# Altium schematic sheet GSB-S05-V00-CAN3.SchDoc
size A4
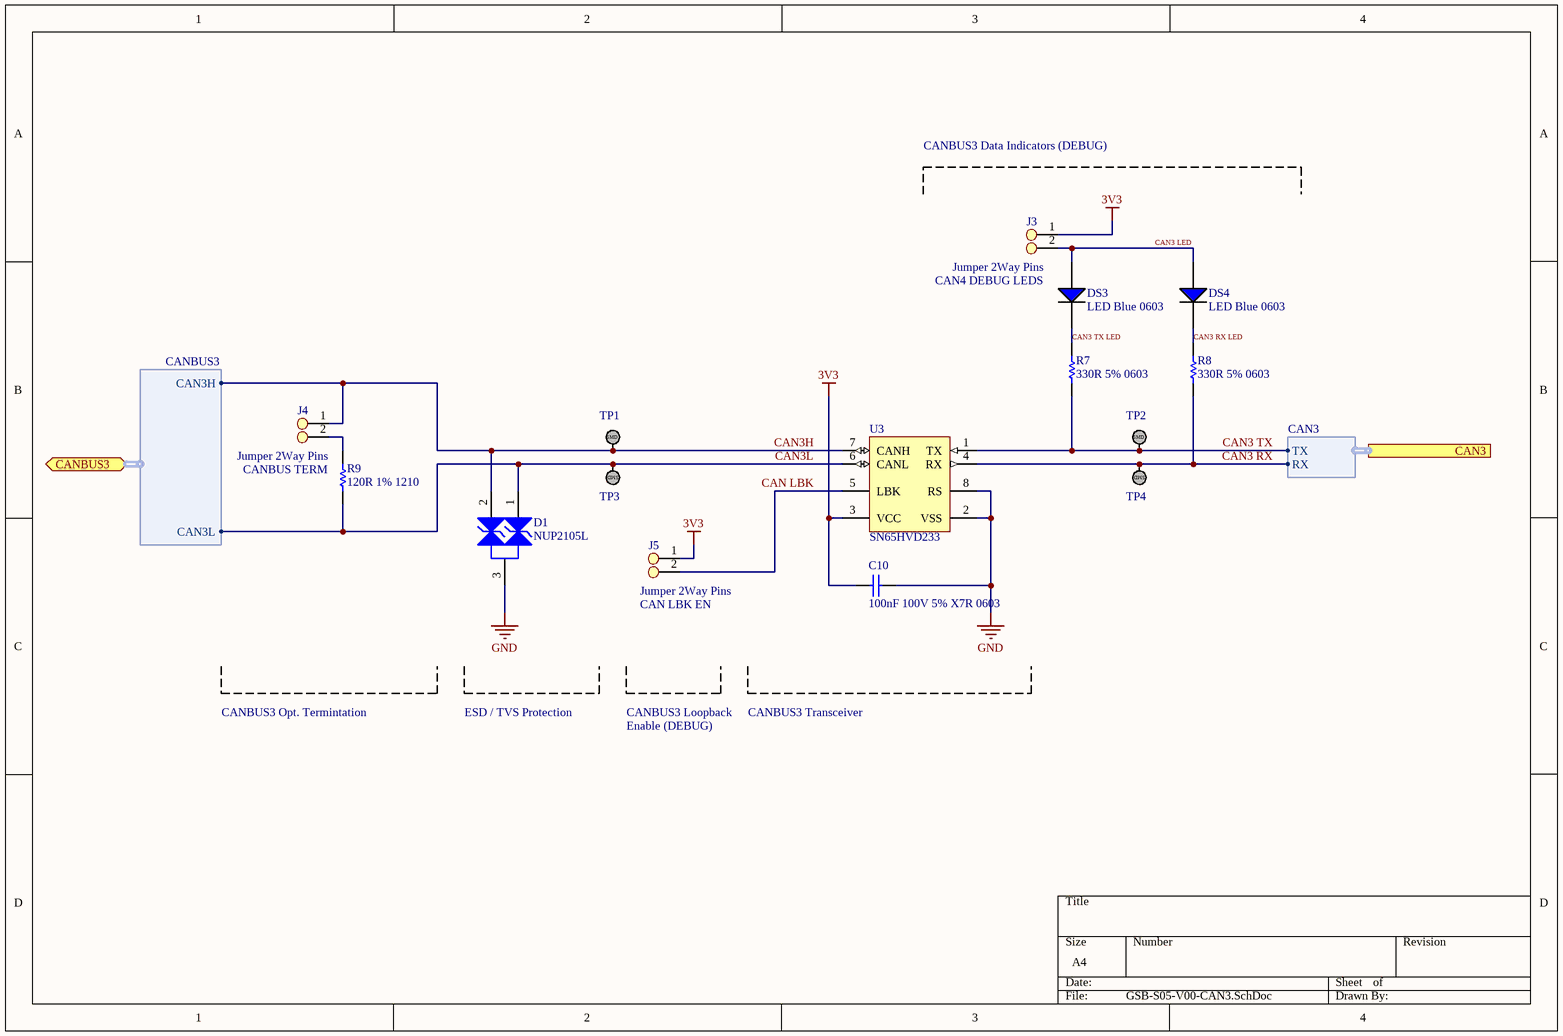
[diagram p0: GSB-S05-V00-CAN3.SchDoc]

## Parts
C10  100nF 100V 5% X7R 0603  [Cap_Ceramic_0603]
D1  NUP2105L  [NUP2105L]
DS3  LED Blue 0603  [LED BLUE 0603]
DS4  LED Blue 0603  [LED BLUE 0603]
J3  Jumper 2Way Pins  [Jumper_2Way_Pin]
J4  Jumper 2Way Pins  [Jumper_2Way_Pin]
J5  Jumper 2Way Pins  [Jumper_2Way_Pin]
R7  330R 5% 0603  [Res_ThinFilm_0603]
R8  330R 5% 0603  [Res_ThinFilm_0603]
R9  120R 1% 1210  [Res_ThinFilm_1210]
TP1  TestPoint_SMD  [TestPointSMD]  (value not drawn)
TP2  TestPoint_SMD  [TestPointSMD]  (value not drawn)
TP3  TestPoint_SMD  [TestPointSMD]  (value not drawn)
TP4  TestPoint_SMD  [TestPointSMD]  (value not drawn)
U3  SN65HVD233  [SN65HVD233DR]

## Ports
CAN3 (harness CAN3), CANBUS3 (bidir, harness CANBUS3)

## Harnesses
CANBUS3: CAN3H, CAN3L
CAN3: RX, TX

## Nets
3V3: C10.2 J3.1 J5.1 U3.3(VCC)
GND: C10.1 D1.3 U3.2(VSS) U3.8(RS)
CAN3 LED: DS3.1(A) DS4.1(A) J3.2
CAN3 RX: R8.1 TP4.1 U3.4(RX) ; port CAN3.RX
CAN3 RX LED: DS4.2(C) R8.2
CAN3 TX: R7.1 TP2.1 U3.1(TX) ; port CAN3.TX
CAN3 TX LED: DS3.2(C) R7.2
CAN3H: D1.2 J4.1 TP1.1 U3.7(CANH) ; port CANBUS3.CAN3H
CAN3L: D1.1 R9.1 TP3.1 U3.6(CANL) ; port CANBUS3.CAN3L
CAN LBK: J5.2 U3.5(LBK)
NetJ4_2: J4.2 R9.2

## Notes on the sheet
- CANBUS3 Data Indicators (DEBUG)
- CAN4 DEBUG LEDS
- (near R9) CANBUS TERM
- (near J5) CAN LBK EN
- CANBUS3 Opt. Termintation
- ESD / TVS Protection
- CANBUS3 Loopback
- CANBUS3 Transceiver
- Enable (DEBUG)
- (in symbol TestPoint_SMD) SMD

## Library data of the parts
C10 = 100nF 100V 5% X7R 0603: Capacitor, Ceramic, SMD, 100nF, 100V, 5%, X7R, 0603
J3-J5 = Jumper 2Way Side Pins
R7 R8 = 330R 5% 0603: Resistor, SMD, 330R, 0.1W, 5%, 0603
R9 = 120R 1% 1210: Resistor, SMD, 120R, 0.25W, 1%, 1210
D1 = NUP2105L: ComponentLink1Description: Datasheet; ComponentLink1URL: https://www.onsemi.cn/PowerSolutions/document/NUP2105L-D.PDF; ComponentLink2Description: LCSC; ComponentLink2URL: https://lcsc.com/product-detail/TVS_ON-Semiconductor-NUP2105LT1G_C14486.html; ComponentLink3Description: Digikey; ComponentLink3URL: https://www.digikey.com.au/product-detail/en/on-semiconductor/SZNUP2105LT1G/SZNUP2105LT1GOSCT-ND/3487669
U3 = SN65HVD233: ComponentLink1Description: LCSC; ComponentLink1URL: https://lcsc.com/product-detail/CAN-ICs_Texas-Instruments_SN65HVD233DRG4_Texas-Instruments-Texas-Instruments-SN65HVD233DRG4_C61643.html; ComponentLink2Description: Digikey; ComponentLink2URL: https://www.digikey.com.au/product-detail/en/texas-instruments/SN65HVD233DR/296-35967-1-ND/4134960; ComponentLink3Description: Datasheet; ComponentLink3URL: https://www.ti.com/lit/ds/symlink/sn65hvd233.pdf?ts=1588560888178; ComponentLink4Description: Ti Product Page; ComponentLink4URL: https://www.ti.com/product/SN65HVD233